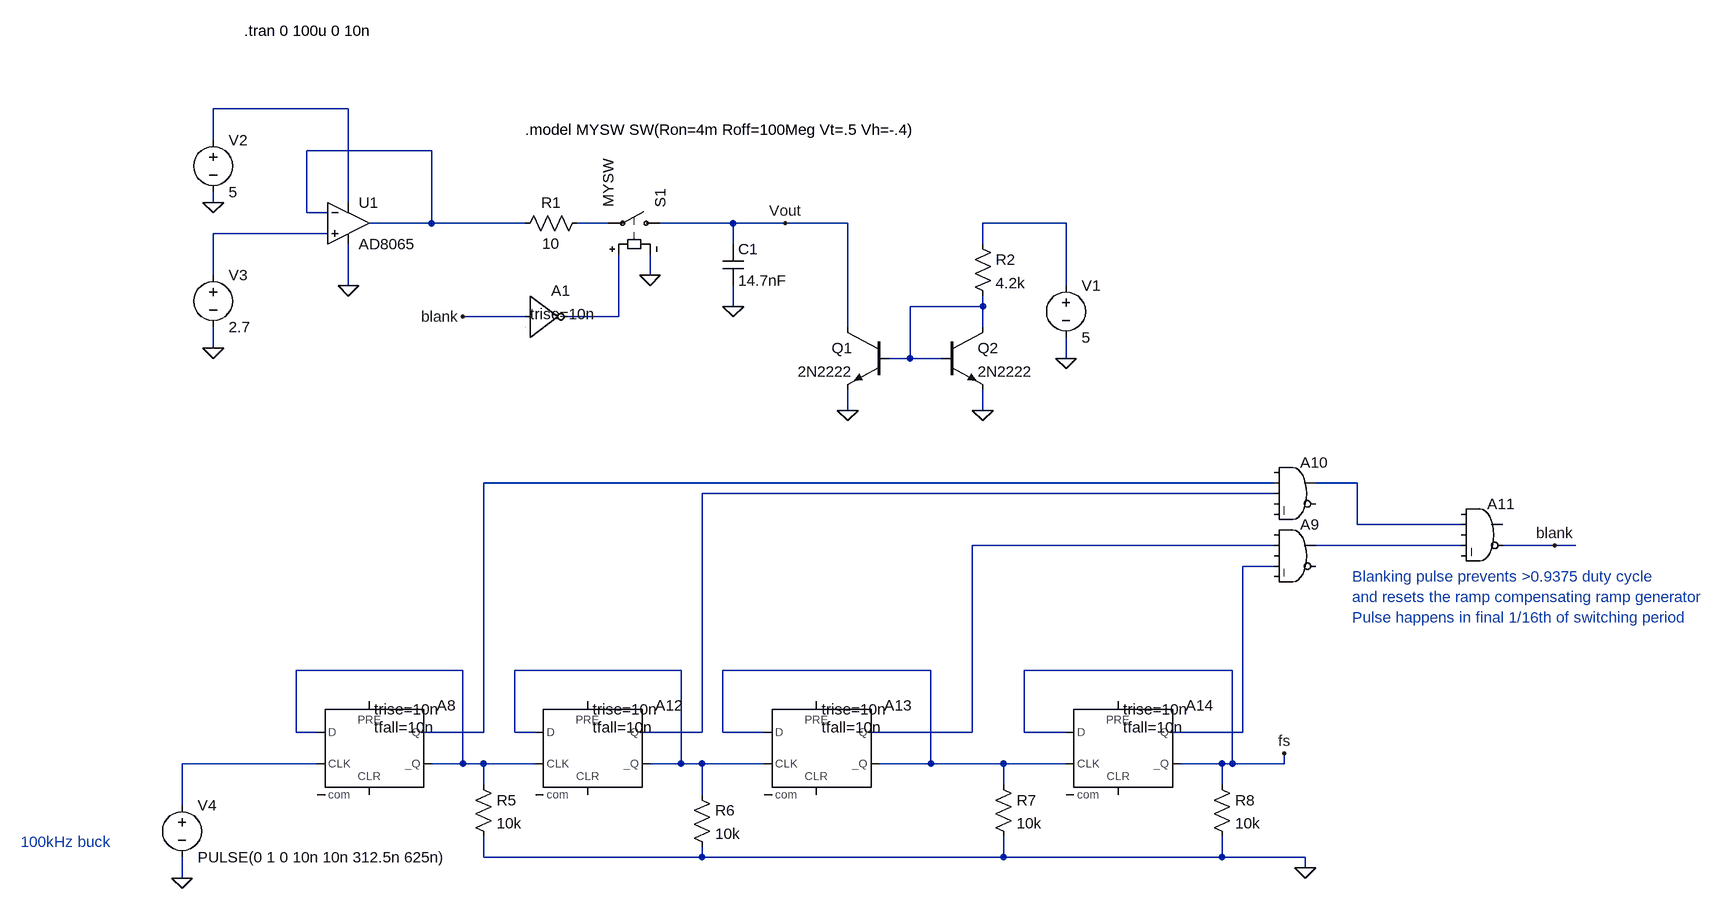
[diagram p0: schematic triangle_gen.asc]
triangle_gen.asc, the LTspice schematic file:
Version 4
SHEET 1 1324 1780
WIRE -880 576 -1088 576
WIRE -1088 624 -1088 576
WIRE -752 640 -944 640
WIRE -1088 720 -1088 704
WIRE -880 720 -880 576
WIRE -944 736 -944 640
WIRE -912 736 -944 736
WIRE -752 752 -752 640
WIRE -752 752 -848 752
WIRE -608 752 -752 752
WIRE -480 752 -528 752
WIRE -288 752 -400 752
WIRE -208 752 -288 752
WIRE -112 752 -208 752
WIRE 224 752 96 752
WIRE -912 768 -1088 768
WIRE -288 784 -288 752
WIRE 96 784 96 752
WIRE -1088 832 -1088 768
WIRE -416 832 -416 800
WIRE -880 848 -880 784
WIRE 224 848 224 752
WIRE -288 880 -288 848
WIRE 96 880 96 864
WIRE 96 880 -16 880
WIRE -608 896 -704 896
WIRE -464 896 -464 800
WIRE -464 896 -544 896
WIRE -112 912 -112 752
WIRE 96 912 96 880
WIRE -1088 944 -1088 912
WIRE -16 960 -16 880
WIRE -16 960 -48 960
WIRE 32 960 -16 960
WIRE 224 960 224 928
WIRE -112 1040 -112 1008
WIRE 96 1040 96 1008
WIRE 544 1152 -672 1152
WIRE 672 1152 608 1152
WIRE 544 1168 -336 1168
WIRE 672 1216 672 1152
WIRE 832 1216 672 1216
WIRE 544 1248 80 1248
WIRE 832 1248 608 1248
WIRE 976 1248 896 1248
WIRE 1008 1248 976 1248
WIRE 544 1280 496 1280
WIRE -704 1440 -960 1440
WIRE -368 1440 -624 1440
WIRE 16 1440 -304 1440
WIRE 480 1440 160 1440
WIRE -960 1536 -960 1440
WIRE -928 1536 -960 1536
WIRE -672 1536 -672 1152
WIRE -672 1536 -768 1536
WIRE -624 1536 -624 1440
WIRE -592 1536 -624 1536
WIRE -336 1536 -336 1168
WIRE -336 1536 -432 1536
WIRE -304 1536 -304 1440
WIRE -240 1536 -304 1536
WIRE 80 1536 80 1248
WIRE 80 1536 -80 1536
WIRE 160 1536 160 1440
WIRE 224 1536 160 1536
WIRE 496 1536 496 1280
WIRE 496 1536 384 1536
WIRE -928 1584 -1136 1584
WIRE -704 1584 -704 1440
WIRE -704 1584 -752 1584
WIRE -672 1584 -704 1584
WIRE -592 1584 -672 1584
WIRE -368 1584 -368 1440
WIRE -368 1584 -416 1584
WIRE -336 1584 -368 1584
WIRE -240 1584 -336 1584
WIRE 16 1584 16 1440
WIRE 16 1584 -64 1584
WIRE 128 1584 16 1584
WIRE 224 1584 128 1584
WIRE 464 1584 400 1584
WIRE 480 1584 480 1440
WIRE 480 1584 464 1584
WIRE 560 1584 560 1568
WIRE 560 1584 480 1584
WIRE -672 1616 -672 1584
WIRE 128 1616 128 1584
WIRE 464 1616 464 1584
WIRE -336 1632 -336 1584
WIRE -1136 1648 -1136 1584
WIRE -672 1728 -672 1696
WIRE -336 1728 -336 1712
WIRE -336 1728 -672 1728
WIRE 128 1728 128 1696
WIRE 128 1728 -336 1728
WIRE 464 1728 464 1696
WIRE 464 1728 128 1728
WIRE 592 1728 464 1728
WIRE 592 1744 592 1728
WIRE -1136 1760 -1136 1728
FLAG -1088 720 0
FLAG -1088 944 0
FLAG -880 848 0
FLAG -208 752 Vout
FLAG -288 880 0
FLAG -704 896 blank
FLAG -416 832 0
FLAG -1136 1760 0
FLAG 560 1568 fs
FLAG 592 1744 0
FLAG 976 1248 blank
FLAG -112 1040 0
FLAG 96 1040 0
FLAG 224 960 0
SYMBOL Opamps\\AD8065 -880 688 R0
SYMATTR InstName U1
SYMBOL voltage -1088 608 R0
WINDOW 123 0 0 Left 0
WINDOW 39 0 0 Left 0
SYMATTR InstName V2
SYMATTR Value 5
SYMBOL voltage -1088 816 R0
WINDOW 123 24 124 Left 2
WINDOW 39 0 0 Left 0
SYMATTR InstName V3
SYMATTR Value 2.7
SYMBOL res -512 736 R90
WINDOW 0 0 56 VBottom 2
WINDOW 3 32 56 VTop 2
SYMATTR InstName R1
SYMATTR Value 10
SYMBOL cap -304 784 R0
SYMATTR InstName C1
SYMATTR Value 14.7nF
SYMATTR SpiceLine IC=2.5
SYMBOL sw -384 752 M270
SYMATTR InstName S1
SYMATTR Value MYSW
SYMBOL voltage -1136 1632 R0
WINDOW 123 0 0 Left 0
WINDOW 39 0 0 Left 0
SYMATTR InstName V4
SYMATTR Value PULSE(0 1 0 10n 10n 312.5n 625n)
SYMBOL Digital\\dflop -848 1488 R0
WINDOW 3 8 12 Left 2
WINDOW 123 8 40 Left 2
SYMATTR Value trise=10n
SYMATTR Value2 tfall=10n
SYMATTR InstName A8
SYMBOL res -688 1600 R0
SYMATTR InstName R5
SYMATTR Value 10k
SYMBOL res -352 1616 R0
SYMATTR InstName R6
SYMATTR Value 10k
SYMBOL res 112 1600 R0
SYMATTR InstName R7
SYMATTR Value 10k
SYMBOL res 448 1600 R0
SYMATTR InstName R8
SYMATTR Value 10k
SYMBOL Digital\\and 576 1200 R0
SYMATTR InstName A9
SYMBOL Digital\\and 576 1104 R0
SYMATTR InstName A10
SYMBOL Digital\\and 864 1168 R0
SYMATTR InstName A11
SYMBOL Digital\\dflop -512 1488 R0
WINDOW 3 8 12 Left 2
WINDOW 123 8 40 Left 2
SYMATTR Value trise=10n
SYMATTR Value2 tfall=10n
SYMATTR InstName A12
SYMBOL Digital\\dflop -160 1488 R0
WINDOW 3 8 12 Left 2
WINDOW 123 8 40 Left 2
SYMATTR Value trise=10n
SYMATTR Value2 tfall=10n
SYMATTR InstName A13
SYMBOL Digital\\dflop 304 1488 R0
WINDOW 3 8 12 Left 2
WINDOW 123 8 40 Left 2
SYMATTR Value trise=10n
SYMATTR Value2 tfall=10n
SYMATTR InstName A14
SYMBOL Digital\\inv -608 832 R0
WINDOW 3 8 60 Left 2
SYMATTR InstName A1
SYMATTR Value trise=10n
SYMATTR Value2 tfall=10n
SYMBOL npn -48 912 M0
SYMATTR InstName Q1
SYMATTR Value 2N2222
SYMBOL npn 32 912 R0
SYMATTR InstName Q2
SYMATTR Value 2N2222
SYMBOL res 80 768 R0
SYMATTR InstName R2
SYMATTR Value 4.2k
SYMBOL voltage 224 832 R0
WINDOW 123 0 0 Left 0
WINDOW 39 0 0 Left 0
SYMATTR InstName V1
SYMATTR Value 5
TEXT -1040 456 Left 2 !.tran 0 100u 0 10n
TEXT -608 608 Left 2 !.model MYSW SW(Ron=4m Roff=100Meg Vt=.5 Vh=-.4)
TEXT 664 1296 Left 2 ;Blanking pulse prevents >0.9375 duty cycle\nand resets the ramp compensating ramp generator\nPulse happens in final 1/16th of switching period
TEXT -1384 1704 Left 2 ;100kHz buck

The netlist it stands for:
* triangle_gen.asc
XU1 N005 N002 N001 0 N002 AD8065  ; pins In+ In- V+ V- OUT
V2 N001 0 5
V3 N005 0 2.7
R1 N003 N002 10
C1 Vout 0 14.7nF IC=2.5
S1 Vout N003 N007 0 MYSW
V4 N017 0 PULSE(0 1 0 10n 10n 312.5n 625n)
A8 N014 0 N017 0 0 N014 N008 0 DFLOP trise=10n tfall=10n
R5 N014 0 10k
R6 N015 0 10k
R7 N016 0 10k
R8 fs 0 10k
A9 0 N011 0 N013 0 0 N012 0 AND
A10 0 N008 N010 0 0 0 N009 0 AND
A11 0 N009 0 N012 0 blank 0 0 AND
A12 N015 0 N014 0 0 N015 N010 0 DFLOP trise=10n tfall=10n
A13 N016 0 N015 0 0 N016 N011 0 DFLOP trise=10n tfall=10n
A14 fs 0 N016 0 0 fs N013 0 DFLOP trise=10n tfall=10n
A1 blank 0 0 0 0 N007 0 0 BUF trise=10n tfall=10n
Q1 Vout N006 0 0 2N2222
Q2 N006 N006 0 0 2N2222
R2 N004 N006 4.2k
V1 N004 0 5
.model NPN NPN
.model PNP PNP
.lib standard.bjt
.tran 0 100u 0 10n
.model MYSW SW(Ron=4m Roff=100Meg Vt=.5 Vh=-.4)
* Blanking pulse prevents >0.9375 duty cycle
* and resets the ramp compensating ramp generator
* Pulse happens in final 1/16th of switching period
* 100kHz buck
.backanno
.end